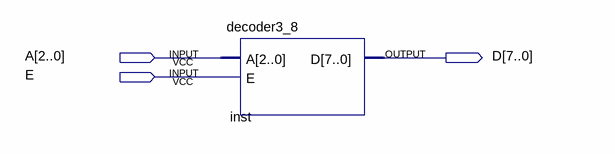
[diagram p0: schematic sheet]
// Quartus schematic test01.bdf as structural Verilog: 1 symbols, 3 pins
module test01 (
  input  [2:0] A,
  input  E,
  output [7:0] D
);

  decoder3_8 inst (.A(A), .E(E), .D(D));
endmodule
